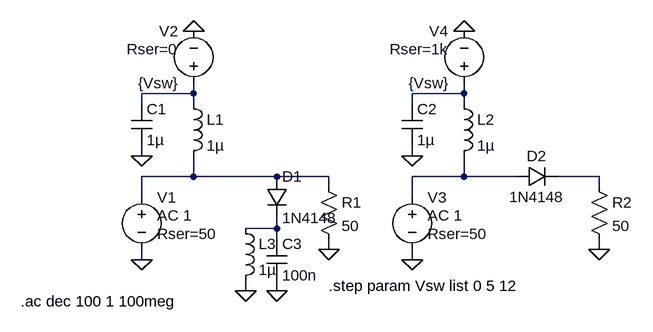
[diagram p0: schematic Switch.asc]
Switch.asc, the LTspice schematic file:
Version 4
SHEET 1 880 680
WIRE 48 -432 48 -448
WIRE 48 -432 -32 -432
WIRE 464 -432 464 -448
WIRE 464 -432 384 -432
WIRE -32 -416 -32 -432
WIRE 48 -416 48 -432
WIRE 384 -416 384 -432
WIRE 464 -416 464 -432
WIRE -32 -336 -32 -352
WIRE 384 -336 384 -352
WIRE 48 -304 48 -336
WIRE 48 -304 -32 -304
WIRE 176 -304 48 -304
WIRE 256 -304 176 -304
WIRE 464 -304 464 -336
WIRE 464 -304 384 -304
WIRE 544 -304 464 -304
WIRE 672 -304 608 -304
WIRE 256 -288 256 -304
WIRE 672 -288 672 -304
WIRE -32 -272 -32 -304
WIRE 384 -272 384 -304
WIRE 176 -224 176 -240
WIRE 176 -224 128 -224
WIRE 176 -208 176 -224
WIRE 256 -192 256 -208
WIRE 672 -192 672 -208
WIRE -32 -176 -32 -192
WIRE 384 -176 384 -192
WIRE 128 -128 128 -144
WIRE 176 -128 176 -144
FLAG 256 -192 0
FLAG -32 -176 0
FLAG -32 -336 0
FLAG 48 -528 0
FLAG 672 -192 0
FLAG 384 -176 0
FLAG 384 -336 0
FLAG 464 -528 0
FLAG 176 -128 0
FLAG 128 -128 0
SYMBOL diode 160 -304 R0
SYMATTR InstName D1
SYMATTR Value 1N4148
SYMBOL res 240 -304 R0
SYMATTR InstName R1
SYMATTR Value 50
SYMBOL ind 32 -432 R0
SYMATTR InstName L1
SYMATTR Value 1µ
SYMATTR SpiceLine Rser=0
SYMBOL voltage -32 -288 R0
WINDOW 123 24 44 Left 2
WINDOW 39 24 72 Left 2
SYMATTR InstName V1
SYMATTR Value ""
SYMATTR Value2 AC 1
SYMATTR SpiceLine Rser=50
SYMBOL voltage 48 -432 R180
WINDOW 0 24 96 Left 2
WINDOW 3 24 16 Left 2
WINDOW 123 0 0 Left 0
WINDOW 39 24 68 Left 2
SYMATTR InstName V2
SYMATTR Value {Vsw}
SYMATTR SpiceLine Rser=0
SYMBOL cap -48 -416 R0
SYMATTR InstName C1
SYMATTR Value 1µ
SYMBOL diode 544 -288 R270
WINDOW 0 32 32 VTop 2
WINDOW 3 0 32 VBottom 2
SYMATTR InstName D2
SYMATTR Value 1N4148
SYMBOL res 656 -304 R0
SYMATTR InstName R2
SYMATTR Value 50
SYMBOL ind 448 -432 R0
SYMATTR InstName L2
SYMATTR Value 1µ
SYMBOL voltage 384 -288 R0
WINDOW 123 24 44 Left 2
WINDOW 39 24 72 Left 2
SYMATTR InstName V3
SYMATTR Value ""
SYMATTR Value2 AC 1
SYMATTR SpiceLine Rser=50
SYMBOL voltage 464 -432 R180
WINDOW 0 24 96 Left 2
WINDOW 3 24 16 Left 2
WINDOW 123 0 0 Left 0
WINDOW 39 24 68 Left 2
SYMATTR InstName V4
SYMATTR Value {Vsw}
SYMATTR SpiceLine Rser=1k
SYMBOL cap 368 -416 R0
SYMATTR InstName C2
SYMATTR Value 1µ
SYMBOL cap 160 -208 R0
SYMATTR InstName C3
SYMATTR Value 100n
SYMBOL ind 112 -240 R0
SYMATTR InstName L3
SYMATTR Value 1µ
SYMATTR SpiceLine Rser=50
TEXT -218 -112 Left 2 !.ac dec 100 1 100meg
TEXT 256 -136 Left 2 !.step param Vsw list 0 5 12

The netlist it stands for:
* Switch.asc
D1 N003 N006 1N4148
R1 N003 0 50
L1 N001 N003 1µ Rser=0
V1 N003 0 AC 1 Rser=50
V2 N001 0 {Vsw} Rser=0
C1 N001 0 1µ
D2 N004 N005 1N4148
R2 N005 0 50
L2 N002 N004 1µ
V3 N004 0 AC 1 Rser=50
V4 N002 0 {Vsw} Rser=1k
C2 N002 0 1µ
C3 N006 0 100n
L3 N006 0 1µ Rser=50
.model D D
.lib standard.dio
.ac dec 100 1 100meg
.step param Vsw list 0 5 12
.backanno
.end